# Altium schematic sheet 5VDC 250mA Buck SMPS.SchDoc: 5VDC 250mA Switching Regulator
size A4; Date: 2017-07-12; DocumentNumber: 3; Revision: A; SheetNumber: 3; SheetTotal: 12; DesignedBy: Craig Comberbach
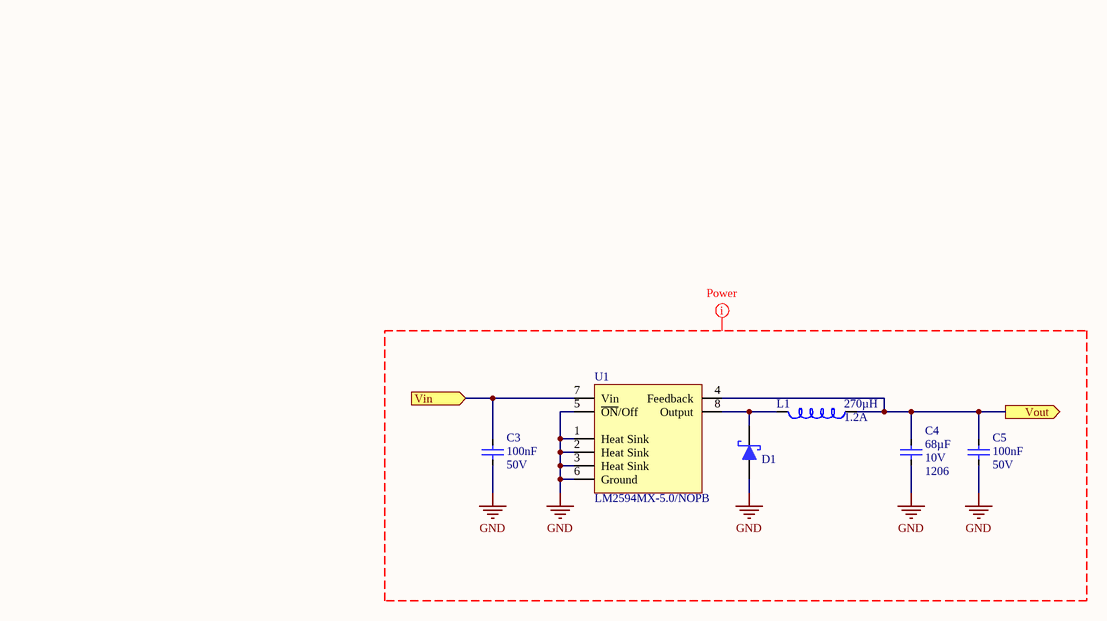
[diagram p0: 5VDC 250mA Buck SMPS.SchDoc]

## Parts
C3  Voltage - Rated: 50V  Capacitance: 100nF  [Capacitor - 0603 Ceramic]  (hidden comment: 100nF 0603 50V)
C4  Voltage - Rated: 10V  Package / Case: 1206  Capacitance: 68µF  (hidden comment: 68uF 1206 10V)
C5  Voltage - Rated: 50V  Capacitance: 100nF  [Capacitor - 0603 Ceramic]  (hidden comment: 100nF 0603 50V)
D1  Schottky Diode 60V 3A  [SMA - Diode]  (value not drawn)
L1  Inductance: 270µH  Current - Saturation: 1.2A  (hidden comment: 270uH SRR1260 1.2A)
U1  Manufacturer Part Number: LM2594MX-5.0/NOPB  (hidden comment: 5VDC 250mA SMPS)

## Ports
Vin (in), Vout (out)

## Nets
GND: C3.2 C4.2 C5.2 D1.1 U1.1(Heat_Sink) U1.2(Heat_Sink) U1.3(Heat_Sink) U1.5(~{ON}/Off) U1.6(Ground)
Vin: C3.1 U1.7(Vin) ; port Vin
Vout: C4.1 C5.1 L1.1 U1.4(Feedback) ; port Vout
NetD1_2: D1.2 L1.2 U1.8(Output)

## Layout directives
net class Power: GND

## Notes on the sheet
- Change Log:
  Rev A	2014-11-19	Craig Comberbach
  Initial Design
  Rev B	2017-01-27	Craig Comberbach
  Added inline nettie for current sensing
  Removed 5.5V MOV from the output
  Added current sensing test clips as well as a ground test clip
- Repository Version
- BOM/Variant

## Library data of the parts
C3 C5 = 100nF 0603 50V: Non-polarized; Manufacturer: Murata Electronics North America; Manufacturer Part Number: GRM188R71H104KA93D; Value: 100 nF 50V 0603 XR7 10%; Tolerance: ±10%; Temperature Coefficient: X7R; Price P/N: 020101-017; Technology: SMT; Supplier 1: Digi-Key; Supplier Part Number 1: 490-1519-1-ND; RoHS: RoHS Compliant; Category: Capacitors; Stock 1: 4132110; Pricing 1: 1=0.12, 10=0.048, 50=0.0256, 100=0.0218, 250=0.01776, 500=0.0152, 1000=0.01185 (CAD); Packaging: Cut Tape (CT); Mounting Type: Surface Mount, MLCC; Operating Temperature: -55°C ~ 125°C; Applications: General Purpose; Ratings: -; Package / Case: 0603 (1608 Metric); Size / Dimension: 0.063" L x 0.031" W (1.60mm x 0.80mm); Height - Seated (Max): -; Thickness (Max): 0.035" (0.90mm); Lead Spacing: -; Features: -; Lead Style: -; ComponentLink1URL: http://www.murata.com/products/catalog/pdf/c02e.pdf; ComponentLink1Description: Spec Sheet
C4 = 68uF 1206 10V: Non-polarized; Manufacturer: TDK Corporation; Manufacturer Part Number: C3216X5R1A686M160AC; Tolerance: ±20%; Temperature Coefficient: X5R; Value: 68uF 1206 10V; Supplier 1: Digi-Key; Supplier Part Number 1: 445-14673-1-ND; RoHS: RoHS Compliant; Category: Capacitors; Stock 1: 17695; Pricing 1: 1=1.59, 10=1.252, 100=0.9393, 500=0.70966, 1000=0.62618 (USD); Packaging: Cut Tape (CT); Operating Temperature: -55°C ~ 85°C; Mounting Type: Surface Mount, MLCC; Size / Dimension: 0.126" L x 0.063" W (3.20mm x 1.60mm); Height - Seated (Max): -; Lead Spacing: -; Features: Low ESL; ComponentLink1URL: https://product.tdk.com/info/en/catalog/datasheets/mlcc_commercial_general_en.pdf; ComponentLink1Description: Spec Sheet; Part Status: Active; Ratings: -; Applications: General Purpose; Failure Rate: -; Thickness (Max): 0.071" (1.80mm); Lead Style: -
D1 = Schottky Diode 60V 3A: Schottky Diode; Manufacturer: Diodes Incorporated; Manufacturer Part Number: B360A-13-F; Voltage - Forward (Vf) (Max) @ If: 700mV @ 3A; Speed: Fast Recovery =< 500ns, > 200mA (Io); Current - Reverse Leakage @ Vr: 500µA @ 60V; Capacitance @ Vr, F: 200pF @ 4V, 1MHz; Price P/N: 020107-024; Technology: SMT; Value: Schottky Diode 60V 3A; Supplier 1: Digi-Key; Supplier Part Number 1: B360A-FDICT-ND; RoHS: RoHS Compliant; Category: Discrete Semiconductor Products; Stock 1: 36234; Pricing 1: 1=0.63, 10=0.51, 25=0.4468, 100=0.3828, 250=0.3306, 500=0.2842, 1000=0.21609, 2500=0.19903 (CAD); Packaging: Cut Tape (CT); Diode Type: Schottky; Voltage - DC Reverse (Vr) (Max): 60V; Current - Average Rectified (Io): 3A; Reverse Recovery Time (trr): -; Mounting Type: Surface Mount; Package / Case: DO-214AC, SMA; Supplier Device Package: SMA; Operating Temperature - Junction: -55°C ~ 150°C; ComponentLink1URL: http://www.diodes.com/datasheets/ds30891.pdf; ComponentLink1Description: Spec Sheet
L1 = 270uH SRR1260 1.2A: Inductor; Manufacturer: Bourns Inc.; Manufacturer Part Number: SRR1260-271K; Shielding: Shielded; Tolerance: ±10%; Type: Wirewound; Material - Core: Ferrite; Current Rating: 1.3A; DC Resistance (DCR): 450 mOhm Max; Q @ Freq: 20 @ 796kHz; Frequency - Self Resonant: 3.6MHz; Value: 270uH SRR1260 1.2A; Supplier 1: Digi-Key; Supplier Part Number 1: SRR1260-271KCT-ND; RoHS: RoHS Compliant; Category: Inductors, Coils, Chokes; Stock 1: 13499; Packaging: Cut Tape (CT); ComponentLink1URL: http://www.bourns.com/docs/Product-Datasheets/SRR1260.pdf; ComponentLink1Description: Spec Sheet; Pricing 1: 1=1, 10=0.927, 100=0.6702 (USD); Part Status: Active; Ratings: -; Operating Temperature: -40°C ~ 125°C; Mounting Type: Surface Mount; Package / Case: Nonstandard; Supplier Device Package: -; Size / Dimension: 0.492" L x 0.492" W (12.50mm x 12.50mm); Height - Seated (Max): 0.256" (6.50mm)
U1 = 5VDC 250mA SMPS: Manufacturer: Texas Instruments; Output Type: Fixed; Number of Outputs: 1; Frequency - Switching: 150kHz; Current - Output: 500mA; Synchronous Rectifier: No; Function: Step-Down; Output Configuration: Positive; Topology: Buck; Voltage - Input (Min): 4.5V; Voltage - Input (Max): 40V; Voltage - Output (Min/Fixed): 5V; Supplier 1: Digi-Key; Supplier Part Number 1: LM2594MX-5.0/NOPBCT-ND; RoHS: RoHS Compliant; Category: Integrated Circuits (ICs); Stock 1: 3233; Pricing 1: 1=3.28, 10=2.942, 100=2.4102, 500=2.05176, 1000=1.7304 (USD); Packaging: Cut Tape (CT); Operating Temperature: -40°C ~ 125°C (TJ); Mounting Type: Surface Mount; Package / Case: 8-SOIC (0.154", 3.90mm Width); Supplier Device Package: 8-SOIC; ComponentLink1URL: http://www.ti.com/lit/ds/symlink/lm2594.pdf; ComponentLink1Description: Spec Sheet; Value: 5VDC 250mA SMPS; Part Status: Active; Voltage - Output (Max): -